# Altium schematic sheet RFID Reader Architecture.SchDoc
size A3; SheetNumber: 2; SheetTotal: 8; SHEET_LYR_NAME: RFID Reader Architecture
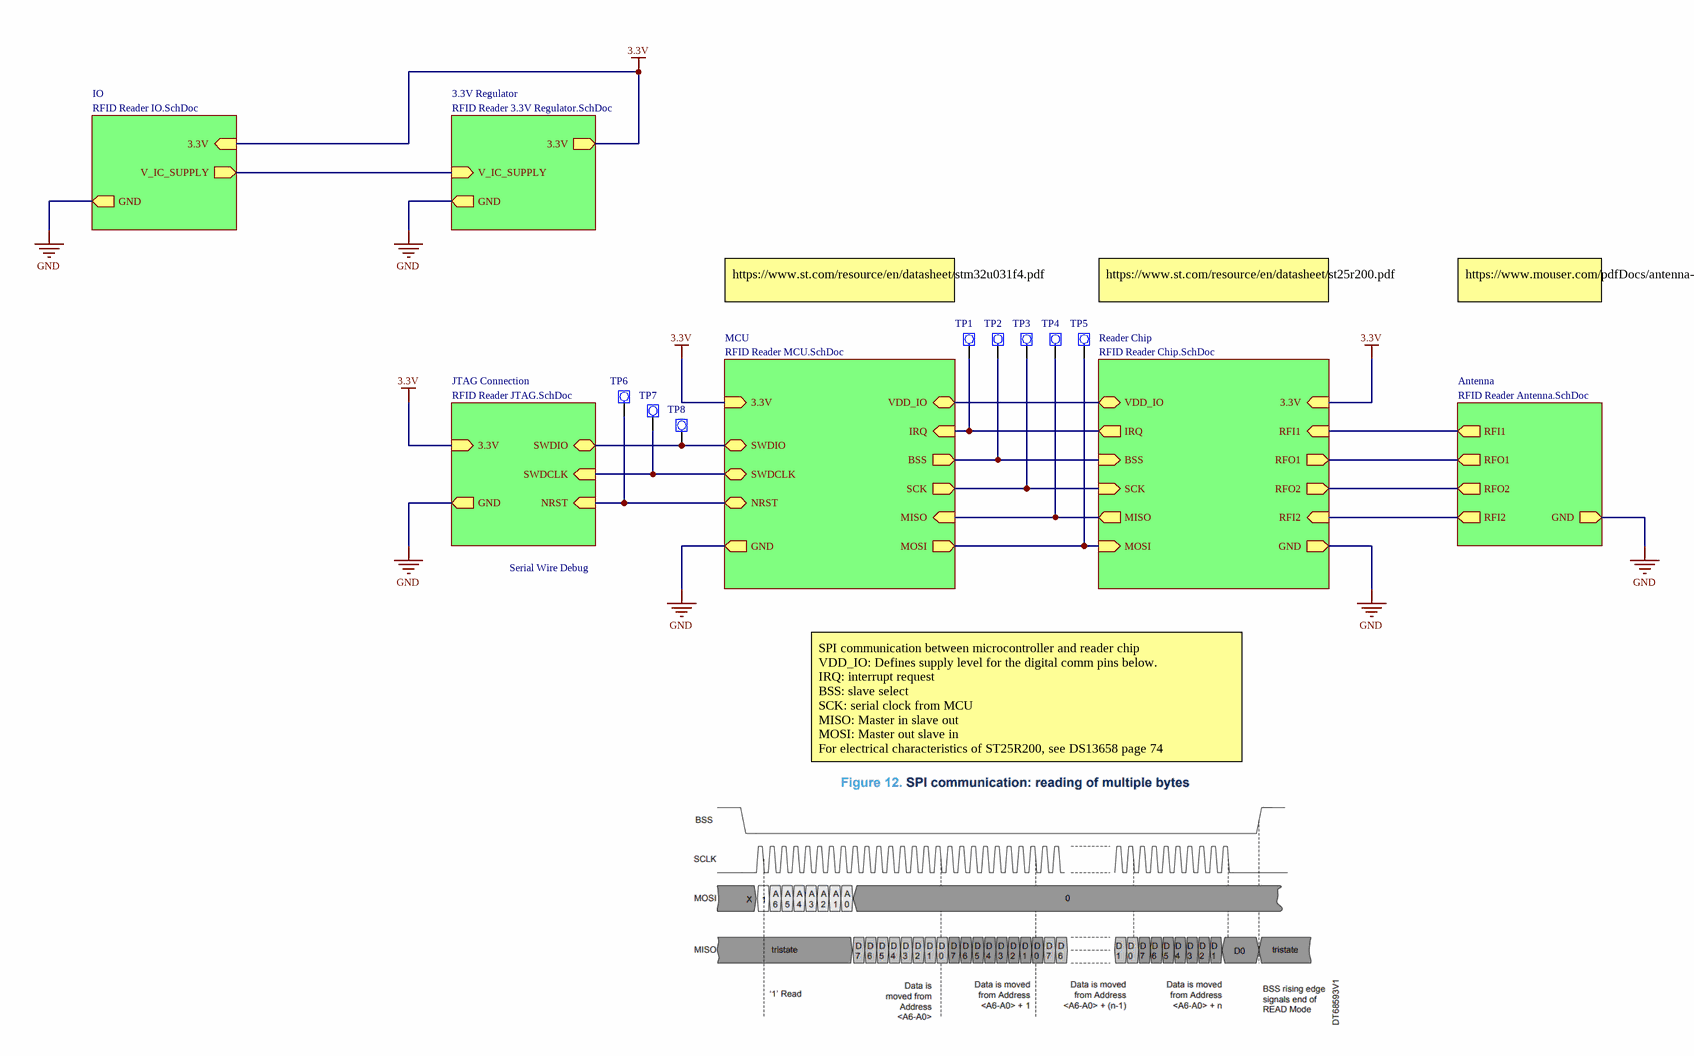
[diagram p0: RFID Reader Architecture.SchDoc]

## Parts
?  (no value)  (graphical)
TP1  40 mil Circular Test Point Pad  [TESTPOINT_40]  (value not drawn)
TP2  40 mil Circular Test Point Pad  [TESTPOINT_40]  (value not drawn)
TP3  40 mil Circular Test Point Pad  [TESTPOINT_40]  (value not drawn)
TP4  40 mil Circular Test Point Pad  [TESTPOINT_40]  (value not drawn)
TP5  40 mil Circular Test Point Pad  [TESTPOINT_40]  (value not drawn)
TP6  40 mil Circular Test Point Pad  [TESTPOINT_40]  (value not drawn)
TP7  40 mil Circular Test Point Pad  [TESTPOINT_40]  (value not drawn)
TP8  40 mil Circular Test Point Pad  [TESTPOINT_40]  (value not drawn)

## Sub-sheets
3.3V Regulator = RFID Reader 3.3V Regulator.SchDoc: GND (out), 3.3V (out), V_IC_SUPPLY (in)
Antenna = RFID Reader Antenna.SchDoc: RFI1 (out), RFO1 (out), RFO2 (out), RFI2 (out), GND (out)
IO = RFID Reader IO.SchDoc: V_IC_SUPPLY (out), 3.3V (in), GND (out)
JTAG Connection = RFID Reader JTAG.SchDoc: GND (out), 3.3V (in), NRST (in), SWDCLK (in), SWDIO (bidir)
MCU = RFID Reader MCU.SchDoc: BSS (out), SCK (out), MOSI (out), MISO (in), IRQ (in), VDD_IO (bidir), GND (out), 3.3V (in), SWDIO (bidir), SWDCLK (bidir), NRST (bidir)
Reader Chip = RFID Reader Chip.SchDoc: BSS (in), SCK (in), MOSI (in), MISO (out), IRQ (out), VDD_IO (bidir), 3.3V (in), GND (out), RFI2 (in), RFO2 (out), RFO1 (out), RFI1 (in)

## Nets
3.3V: sheet 3.3V Regulator/3.3V, sheet Reader Chip/3.3V, sheet MCU/3.3V, sheet JTAG Connection/3.3V, sheet IO/3.3V
GND: sheet 3.3V Regulator/GND, sheet Reader Chip/GND, sheet MCU/GND, sheet JTAG Connection/GND, sheet Antenna/GND, sheet IO/GND
NetTP1_1: TP1.1(TSTPNT) ; sheet Reader Chip/IRQ, sheet MCU/IRQ
NetTP2_1: TP2.1(TSTPNT) ; sheet Reader Chip/BSS, sheet MCU/BSS
NetTP3_1: TP3.1(TSTPNT) ; sheet Reader Chip/SCK, sheet MCU/SCK
NetTP4_1: TP4.1(TSTPNT) ; sheet Reader Chip/MISO, sheet MCU/MISO
NetTP5_1: TP5.1(TSTPNT) ; sheet Reader Chip/MOSI, sheet MCU/MOSI
NetTP6_1: TP6.1(TSTPNT) ; sheet MCU/NRST, sheet JTAG Connection/NRST
NetTP7_1: TP7.1(TSTPNT) ; sheet MCU/SWDCLK, sheet JTAG Connection/SWDCLK
NetTP8_1: TP8.1(TSTPNT) ; sheet MCU/SWDIO, sheet JTAG Connection/SWDIO
(unnamed): sheet 3.3V Regulator/V_IC_SUPPLY, sheet IO/V_IC_SUPPLY
(unnamed): sheet Reader Chip/VDD_IO, sheet MCU/VDD_IO
(unnamed): sheet Reader Chip/RFI2, sheet Antenna/RFI2
(unnamed): sheet Reader Chip/RFO2, sheet Antenna/RFO2
(unnamed): sheet Reader Chip/RFO1, sheet Antenna/RFO1
(unnamed): sheet Reader Chip/RFI1, sheet Antenna/RFI1

## Notes on the sheet
- https://www.st.com/resource/en/datasheet/stm32u031f4.pdf
- https://www.st.com/resource/en/datasheet/st25r200.pdf
- https://www.mouser.com/pdfDocs/antenna-design-for-st25r200-and-st25r100.pdf?srsltid=AfmBOorGLWoVCnaexNwscurUt2KcnXmgEqyJUwgFgLRLmCbh3nBSTvoR
- Serial Wire Debug
- SPI communication between microcontroller and reader chip
  VDD_IO: Defines supply level for the digital comm pins below.
  IRQ: interrupt request
  BSS: slave select
  SCK: serial clock from MCU
  MISO: Master in slave out
  MOSI: Master out slave in
  For electrical characteristics of ST25R200, see DS13658 page 74
- LAYER NAME
- CRITICAL QUALITY ATTRIBUTE
- TITLE NAME
- THIS DRAWING CONTAINS CONFIDENTIAL INFORMATION AND IS ISSUED IN CONFIDENCE ON THE CONDITIONS
  THAT IT BE RETURNED ON DEMAND AND NOT BE COPIED, REPRODUCED, DISCLOSED TO OTHERS OR USED
  IN THE MANUFACTURE OF THE SUBJECT-MATTER THEREOF WITHOUT THE WRITTEN CONSENT OF
  STRYKER CORPORATION.
- SHALL BE COMPLIANT PER ES-1168 AND ES-1005
- SHEET
- OF
- NUMBER
- REV
- APPROVALS ARE FOUND IN PLM SYSTEM

## Library data of the parts
? = CMP-001-0000-v0.01.17: Stryker standard title block with pre-parameterized fields
TP1-TP8 = CMP-001-0175-v0.01.07: Manufacturer: Stryker; Manufacturer Part Number: Copper Feature; Device Width: 0mm; Plating: 0; Test Point Signal Structure: Unknown; Test Point Is Used: X; Style Guide Revision: Librarian to Review; Critical Component: -; RoHS Compliance: Unknown; Material - Insulation: 0; Operating Temperature - Max: 0°C; Color: n/a; Device Height: 0mm; Operating Temperature - Min: 0°C; Hole Diameter: 0mm; Device Length: 0mm; Device Height Above Board: 0mm; Pin Count: 1; REACH Compliance: Unknown; Material - Body: 0; Mounting Technology: SMT